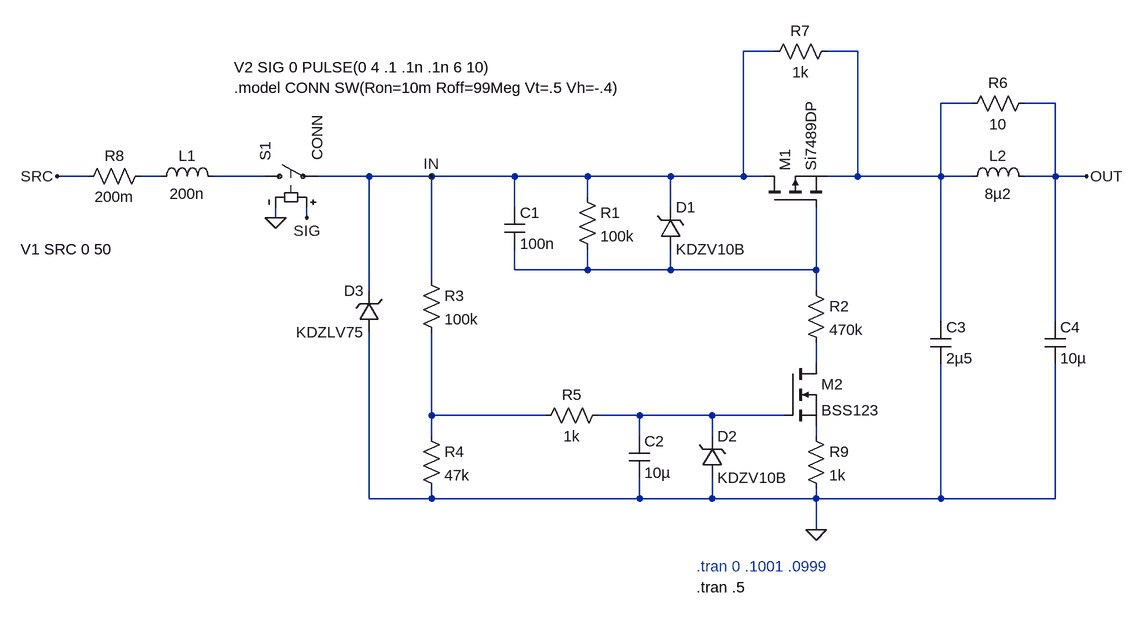
[diagram p0: schematic precharge_concept.asc]
precharge_concept.asc, the LTspice schematic file:
Version 4
SHEET 1 880 744
WIRE 224 -96 176 -96
WIRE 352 -96 304 -96
WIRE 528 -16 480 -16
WIRE 656 -16 608 -16
WIRE -832 96 -880 96
WIRE -720 96 -752 96
WIRE -560 96 -640 96
WIRE -400 96 -480 96
WIRE -304 96 -400 96
WIRE -176 96 -304 96
WIRE -64 96 -176 96
WIRE 64 96 -64 96
WIRE 176 96 176 -96
WIRE 176 96 64 96
WIRE 208 96 176 96
WIRE 352 96 352 -96
WIRE 352 96 304 96
WIRE 480 96 480 -16
WIRE 480 96 352 96
WIRE 528 96 480 96
WIRE 656 96 656 -16
WIRE 656 96 608 96
WIRE 704 96 656 96
WIRE -64 128 -64 96
WIRE -176 144 -176 96
WIRE 64 144 64 96
WIRE -544 160 -544 144
WIRE -496 160 -496 144
WIRE -176 240 -176 208
WIRE -64 240 -64 208
WIRE -64 240 -176 240
WIRE 64 240 64 208
WIRE 64 240 -64 240
WIRE 288 240 288 144
WIRE 288 240 64 240
WIRE -304 256 -304 96
WIRE -400 272 -400 96
WIRE 288 272 288 240
WIRE 480 320 480 96
WIRE 656 320 656 96
WIRE 288 384 288 352
WIRE -304 464 -304 336
WIRE -128 464 -304 464
WIRE 16 464 -48 464
WIRE 128 464 16 464
WIRE 240 464 128 464
WIRE -304 496 -304 464
WIRE 16 496 16 464
WIRE 128 496 128 464
WIRE 288 496 288 480
WIRE -400 592 -400 336
WIRE -304 592 -304 576
WIRE -304 592 -400 592
WIRE 16 592 16 560
WIRE 16 592 -304 592
WIRE 128 592 128 560
WIRE 128 592 16 592
WIRE 288 592 288 576
WIRE 288 592 128 592
WIRE 480 592 480 384
WIRE 480 592 288 592
WIRE 656 592 656 384
WIRE 656 592 480 592
WIRE 288 640 288 592
FLAG 288 640 0
FLAG -880 96 SRC
FLAG 704 96 OUT
FLAG -544 160 0
FLAG -496 160 SIG
FLAG -304 96 IN
SYMBOL pmos 208 144 R270
SYMATTR InstName M1
SYMATTR Value Si7489DP
SYMBOL nmos 240 384 R0
SYMATTR InstName M2
SYMATTR Value BSS123
SYMBOL res -80 112 R0
SYMATTR InstName R1
SYMATTR Value 100k
SYMBOL res 272 256 R0
SYMATTR InstName R2
SYMATTR Value 470k
SYMBOL zener 48 208 M180
WINDOW 0 24 64 Left 2
WINDOW 3 24 0 Left 2
SYMATTR InstName D1
SYMATTR Value KDZV10B
SYMATTR Description Diode
SYMATTR Type diode
SYMBOL cap -192 144 R0
SYMATTR InstName C1
SYMATTR Value 100n
SYMBOL zener 112 560 M180
WINDOW 0 24 64 Left 2
WINDOW 3 24 0 Left 2
SYMATTR InstName D2
SYMATTR Value KDZV10B
SYMATTR Description Diode
SYMATTR Type diode
SYMBOL cap 0 496 R0
SYMATTR InstName C2
SYMATTR Value 10µ
SYMBOL res -320 240 R0
SYMATTR InstName R3
SYMATTR Value 100k
SYMBOL res -320 480 R0
SYMATTR InstName R4
SYMATTR Value 47k
SYMBOL res -32 448 R90
WINDOW 0 0 56 VBottom 2
WINDOW 3 32 56 VTop 2
SYMATTR InstName R5
SYMATTR Value 1k
SYMBOL cap 464 320 R0
SYMATTR InstName C3
SYMATTR Value 2µ5
SYMATTR SpiceLine Rser=2m
SYMBOL res 320 -112 R90
WINDOW 0 0 56 VBottom 2
WINDOW 3 32 56 VTop 2
SYMATTR InstName R7
SYMATTR Value 1k
SYMBOL res -736 80 R90
WINDOW 0 0 56 VBottom 2
WINDOW 3 32 56 VTop 2
SYMATTR InstName R8
SYMATTR Value 200m
SYMBOL ind -736 112 R270
WINDOW 0 32 56 VTop 2
WINDOW 3 5 56 VBottom 2
SYMATTR InstName L1
SYMATTR Value 200n
SYMBOL ind 512 112 R270
WINDOW 0 32 56 VTop 2
WINDOW 3 5 56 VBottom 2
SYMATTR InstName L2
SYMATTR Value 8µ2
SYMBOL cap 640 320 R0
SYMATTR InstName C4
SYMATTR Value 10µ
SYMBOL res 624 -32 R90
WINDOW 0 0 56 VBottom 2
WINDOW 3 32 56 VTop 2
SYMATTR InstName R6
SYMATTR Value 10
SYMBOL sw -576 96 R270
SYMATTR InstName S1
SYMATTR Value CONN
SYMBOL zener -384 336 R180
WINDOW 0 24 64 Left 2
WINDOW 3 24 0 Left 2
SYMATTR InstName D3
SYMATTR Value KDZLV75
SYMBOL res 272 480 R0
SYMATTR InstName R9
SYMATTR Value 1k
TEXT -936 208 Left 2 !V1 SRC 0 50
TEXT 104 696 Left 2 ;.tran 0 .1001 .0999
TEXT -608 -40 Left 2 !.model CONN SW(Ron=10m Roff=99Meg Vt=.5 Vh=-.4)
TEXT -608 -72 Left 2 !V2 SIG 0 PULSE(0 4 .1 .1n .1n 6 10)
TEXT 104 728 Left 2 !.tran .5

The netlist it stands for:
* precharge_concept.asc
M1 IN N004 N001 N001 Si7489DP
M2 N005 N007 N008 N008 BSS123
R1 IN N004 100k
R2 N004 N005 470k
D1 N004 IN KDZV10B
C1 IN N004 100n
D2 0 N007 KDZV10B
C2 N007 0 10µ
R3 IN N006 100k
R4 N006 0 47k
R5 N007 N006 1k
C3 N001 0 2µ5 Rser=2m
R7 N001 IN 1k
R8 N002 SRC 200m
L1 N002 N003 200n
L2 N001 OUT 8µ2
C4 OUT 0 10µ
R6 OUT N001 10
S1 N003 IN SIG 0 CONN
D3 0 IN KDZLV75
R9 N008 0 1k
.model D D
.lib standard.dio
.model NMOS NMOS
.model PMOS PMOS
.lib standard.mos
V1 SRC 0 50
* .tran 0 .1001 .0999
.model CONN SW(Ron=10m Roff=99Meg Vt=.5 Vh=-.4)
V2 SIG 0 PULSE(0 4 .1 .1n .1n 6 10)
.tran .5
.backanno
.end